# Altium schematic sheet Power.SchDoc
size A3
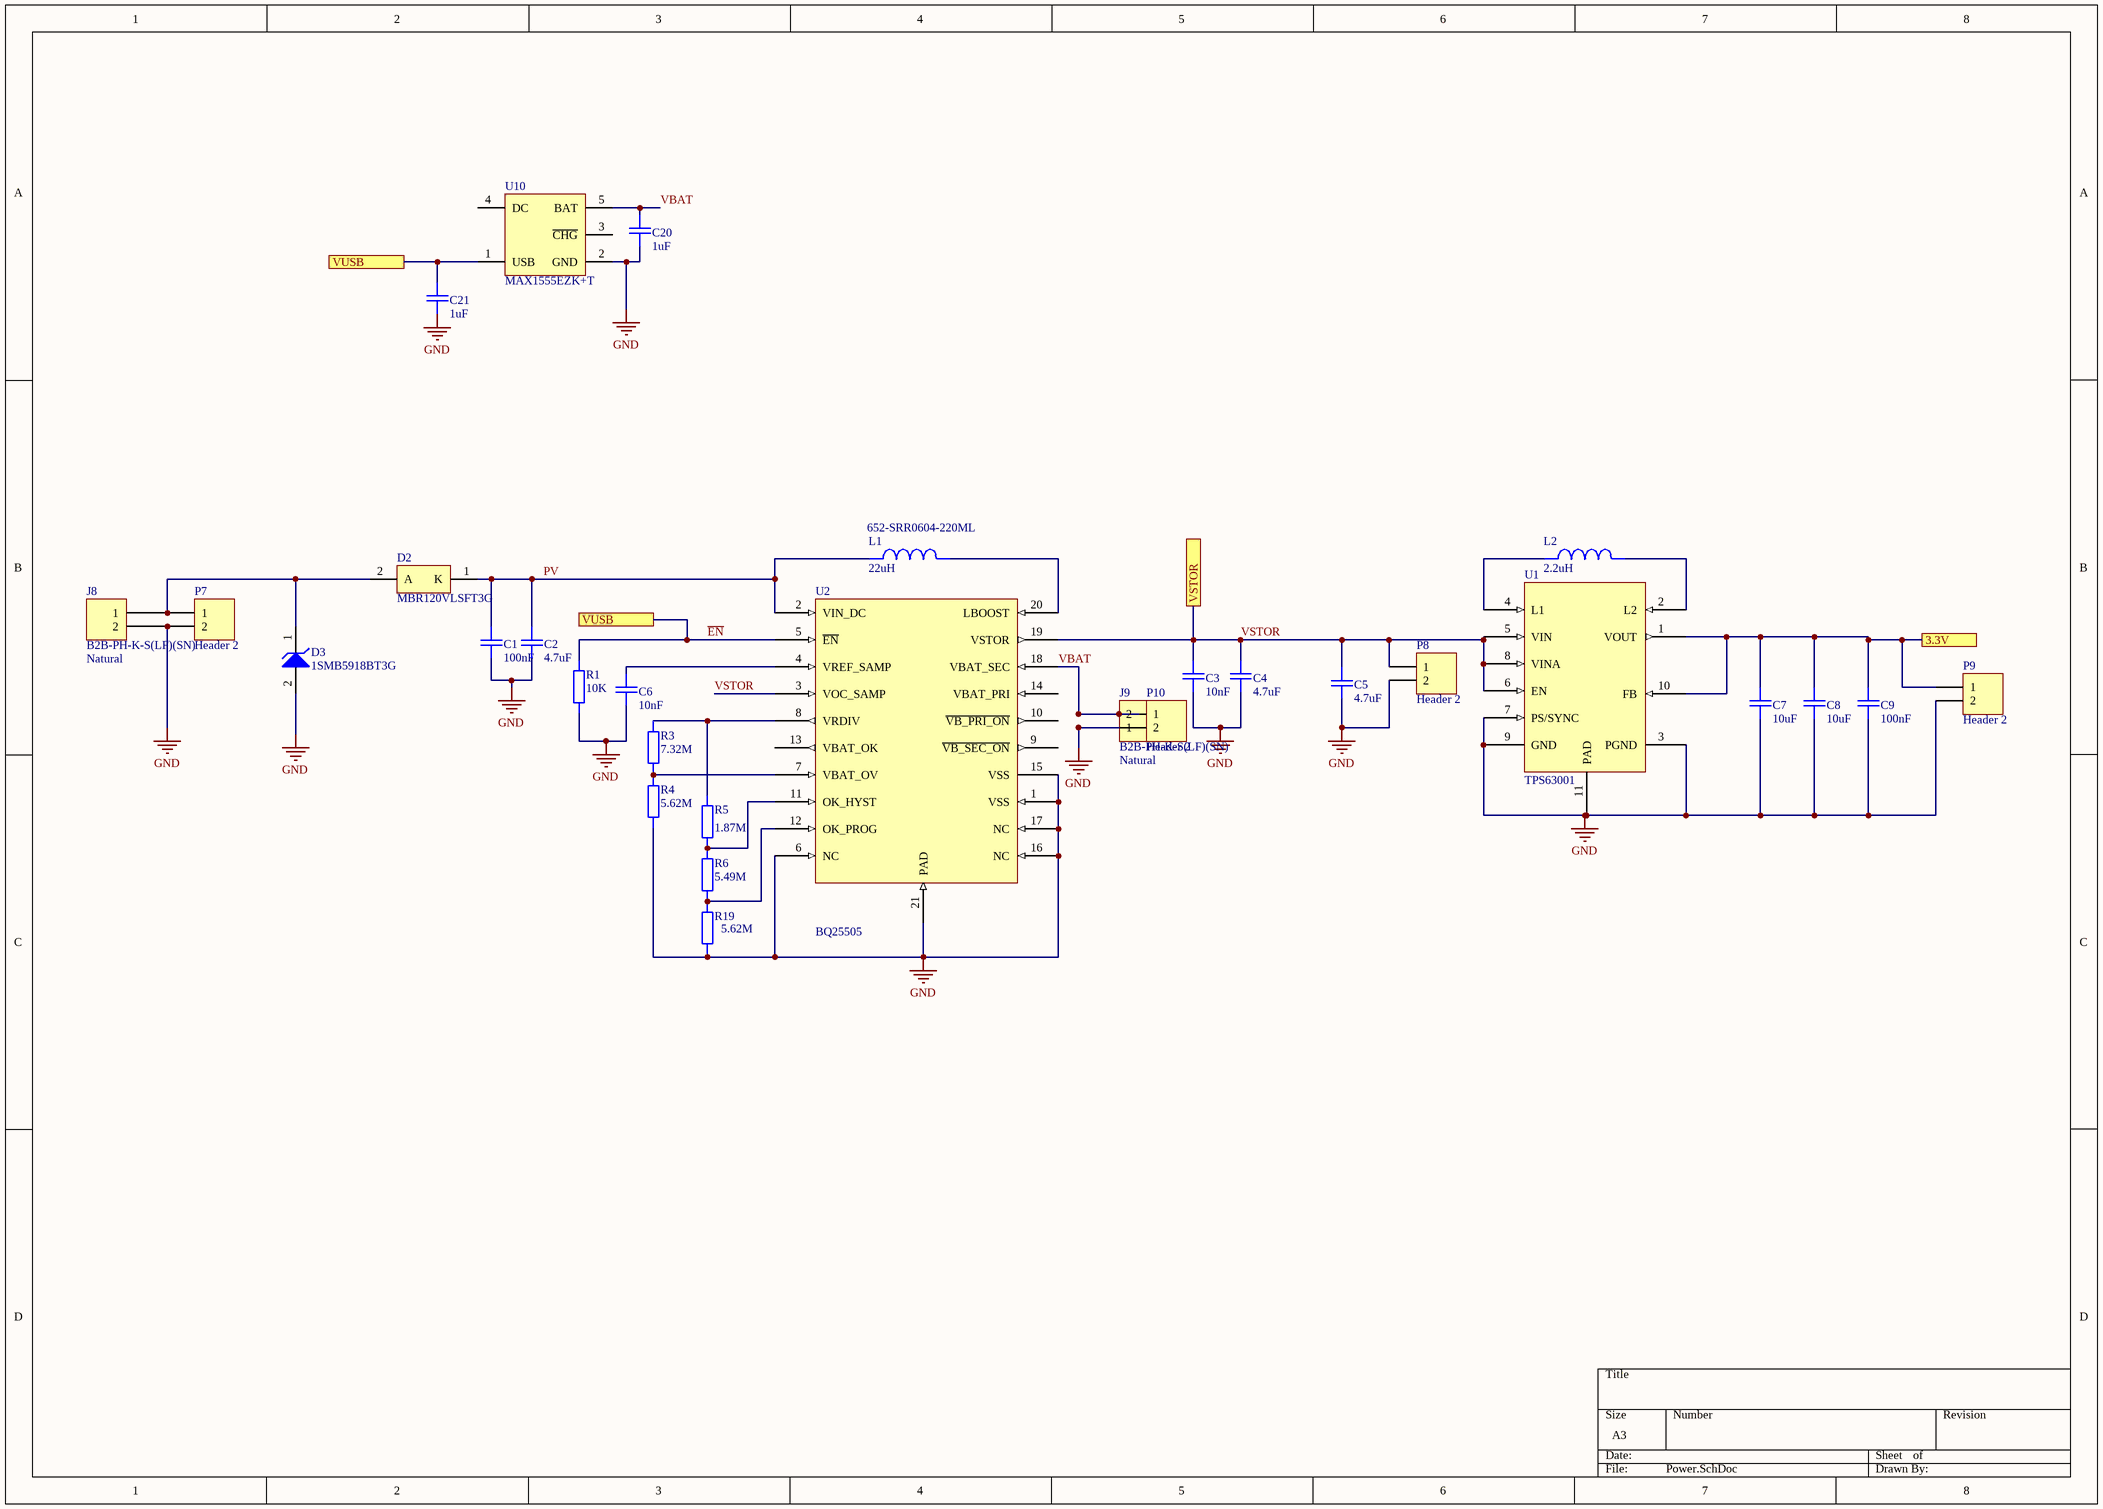
[diagram p0: Power.SchDoc]

## Parts
C1  value 100nF  [C0805]  (hidden comment: Capacitor)
C2  value 4.7uF  [C0805]  (hidden comment: Capacitor)
C3  value 10nF  [C0805]  (hidden comment: Capacitor)
C4  value 4.7uF  [C0805]  (hidden comment: Capacitor)
C5  value 4.7uF  [C0805]  (hidden comment: Capacitor)
C6  value 10nF  [C0805]  (hidden comment: Capacitor)
C7  value 10uF  [C0805]  (hidden comment: Capacitor)
C8  value 10uF  [C0805]  (hidden comment: Capacitor)
C9  value 100nF  [C0805]  (hidden comment: Capacitor)
C20  value 1uF  [C0805]  (hidden comment: Capacitor)
C21  value 1uF  [C0805]  (hidden comment: Capacitor)
D2  MBR120VLSFT3G  [ONSC-SOD-123FL-2-498-01_V]
D3  1SMB5918BT3G  [ONSC-SMB-2-403A-03_H_V]
J8  B2B-PH-K-S(LF)(SN)  Colour: Natural  [JST B2B-PH-K]
J9  B2B-PH-K-S(LF)(SN)  Colour: Natural  [JST B2B-PH-K]
L1  value 22uH  Supplier Part Number 1: 652-SRR0604-220ML  [SRR0604]  (hidden comment: Inductor)
L2  value 2.2uH  [MLP2520]  (hidden comment: Inductor)
P7  Header 2  [HDR1X2]
P8  Header 2  [HDR1X2]
P9  Header 2  [HDR1X2]
P10  Header 2  [HDR1X2]
R1  value 10K  [6-0805_L]  (hidden comment: Resistor)
R3  value 7.32M  [6-0805_L]  (hidden comment: Resistor)
R4  value 5.62M  [6-0805_L]  (hidden comment: Resistor)
R5  value 1.87M  [6-0805_L]  (hidden comment: Resistor)
R6  value 5.49M  [6-0805_L]  (hidden comment: Resistor)
R19  value 5.62M  [6-0805_L]  (hidden comment: Resistor)
U1  TPS63001  [DRC0010J]
U2  BQ25505  [S-PVQFN-N20]
U10  MAX1555EZK+T  [MAXM-Z5+1_N]

## Ports
3.3V, VSTOR, VUSB

## Nets
GND: C1.2 C2.2 C3.2 C4.2 C5.2 C6.2 C7.2 C8.2 C9.2 C20.2 C21.2 D3.2(A) J8.2 J9.1 P7.2 P8.2 P9.2 P10.2 R1.2 R4.2 R19.2 U1.3(PGND) U1.7(PS/SYNC) U1.9(GND) U1.11(PAD) U2.1(VSS) U2.6(NC) U2.15(VSS) U2.16(NC) U2.17(NC) U2.21(PAD) U10.2(GND)
3.3V: C7.1 C8.1 C9.1 P9.1 U1.1(VOUT) U1.10(FB) ; port 3.3V
~{EN}: C21.1 R1.1 U2.5(~{EN}) U10.1(USB) ; port VUSB
PV: C1.1 C2.1 D2.1(K) L1.1 U2.2(VIN_DC)
VBAT: C20.1 J9.2 P10.1 U2.18(VBAT_SEC) U10.5(BAT)
VSTOR: C3.1 C4.1 C5.1 P8.1 U1.5(VIN) U1.6(EN) U1.8(VINA) U2.3(VOC_SAMP) U2.19(VSTOR) ; port VSTOR
NetC6_1: C6.1 U2.4(VREF_SAMP)
NetD2_2: D2.2(A) D3.1(K) J8.1 P7.1
NetL1_2: L1.2 U2.20(LBOOST)
NetL2_1: L2.1 U1.4(L1)
NetL2_2: L2.2 U1.2(L2)
NetR3_1: R3.1 R5.1 U2.8(VRDIV)
NetR3_2: R3.2 R4.1 U2.7(VBAT_OV)
NetR5_2: R5.2 R6.1 U2.11(OK_HYST)
NetR6_2: R6.2 R19.1 U2.12(OK_PROG)

Not connected (* = marked no-connect by the designer): U2 9(~{VB_SEC_ON}) 10(~{VB_PRI_ON}) 13(VBAT_OK) 14(VBAT_PRI); U10 3(~{CHG}) 4(DC)

## Library data of the parts
C1-C9 C20 C21 = Capacitor: Voltage: 16V; Tolerance: 10%; Package: 0603
D2 = CMP-1055-00447-1: Schottky Power Rectifier, 2-Pin SOD-123, Pb-Free, Tape and Reel; Manufacturer: On Semiconductor; Configuration: Single; IFSM Max (A): 45; ComponentLink2URL: http://www.onsemi.cn/pub_link/Collateral/MBR120VLSFT1-D.PDF; PartNumber: MBR120VLSFT3G; DatasheetVersion: Rev. 2; PackageVersion: Rev. A; PackageDescription: 2-Pin SOD, Body 1.65 x 2.7 mm; ComponentLink1URL: http://www.onsemi.com/; ComponentLink3URL: http://www.onsemi.cn/pub_link/Collateral/MBR120VLSFT1-D.PDF; Packing: Tape and Reel; Mounting Technology: Surface Mount; ComponentLink1Description: Manufacturer URL; ComponentLink3Description: Package Specification; ComponentLink2Description: Datasheet; PackageReference: SOD-123FL-2-498-01; RoHS: TRUE
D3 = CMP-1060-00206-1: 3 W Zener Voltage Regulator, 2-Pin SMB, Pb-Free, Tape and Reel; Manufacturer: On Semiconductor; VZ Typ (V): 5.1; ComponentLink3URL: http://www.onsemi.com/pub_link/Collateral/1SMB5913BT3-D.PDF; Mounting Technology: Surface Mount; Packing: Tape and Reel; ComponentLink3Description: Package Specification; ComponentLink2URL: http://www.onsemi.com/pub_link/Collateral/1SMB5913BT3-D.PDF; DatasheetVersion: Rev. 8; PackageReference: SMB-2-403A-03_H; ComponentLink2Description: Datasheet; ComponentLink1Description: Manufacturer URL; ComponentLink1URL: http://www.onsemi.com/; RoHS: Pb-Free; PackageDescription: 2-Pin Small Molded Package, J-Bend Lead, Body 4.33 x 3.625 mm; PartNumber: 1SMB5918BT3G; PackageVersion: Rev. H, 05/2011
J8 J9 = B2B-PH-K-S(LF)(SN): CONN HEADER PH TOP 2POS 2MM; Manufacturer: JST Sales America Inc.; Pitch: 0.079" (2.00mm); Number Of Positions: 2; Part Number: B2B-PH-K-S(LF)(SN); PartId: 29447; Supplier 1: Digi-Key; Supplier Part Number 1: 455-1704-ND; ComponentLink1Description: Datasheet; ComponentLink1URL: http://www.jst-mfg.com/product/pdf/eng/ePH.pdf; ComponentLink2Description: Digi-Key Listing; ComponentLink2URL: http://www.digikey.com/product-detail/en/jst-sales-america-inc/B2B-PH-K-S(LF)(SN)/455-1704-ND/926611; Price: 0,17; Type: Header, Shrouded; Contact Finish: Tin; Fastening Type: Detent Lock; Number Of Rows: 1; Series: PH
L1 = Inductor: Manufacturer: Bourns; Core Material: Ferrite; Material: Steel; Tolerance: 20%; Max DC Current: 900mA; DC Resistance (DCR): 190mR; Self Resonant Frequency: 25MHz; Q Factor: 16; Shielding: Shielded; Saturation Current: 1.2A; Test Frequency: 1kHz; Supplier 1: Mouser; Stock 1: 4936; Pricing 1: 1=0.71, 10=0.658, 50=0.658, 100=0.476, 1000=0.365, 10000=0.365 (USD); Mount: Surface Mount; Case/Package: 0604; Min Operating Temperature: -40°C; Max Operating Temperature: 125°C; Inductance: 22uh; Packaging: Tape and Reel; Package Quantity: 1000; Inductance Tolerance: 20%; Current Rating: 900mA; Frequency: 25MHz; Resistance: 190MR; Termination: SMD/SMT; Composition: Wirewound; DC Current: 900mA; Military Standard: Not; RMS Current (Irms): 900mA; Length: 6.5mm; Height: 4.8mm; Width: 6.5mm; Height - Seated (Max): 0.189inch; Depth: 6.7mm; REACH SVHC: No SVHC; ComponentLink1URL: http://uk.rs-online.com/webdocs/0fa5/0900766b80fa5950.pdf; ComponentLink1Description: http://uk.rs-online.com/webdocs/0fa5/0900766b80fa5950.pdf; ComponentLink2URL: https://www.alliedelec.com/m/d/db85a2264958f44ba0f102d64e276dc0.pdf; ComponentLink2Description: https://www.alliedelec.com/m/d/db85a2264958f44ba0f102d64e276dc0.pdf; ComponentLink3URL: http://www.bourns.com/docs/Product-Datasheets/SRR0604.pdf; ComponentLink3Description: http://www.bourns.com/docs/Product-Datasheets/SRR0604.pdf; ComponentLink4URL: https://www.bourns.com/docs/Product-Datasheets/SRR0604.pdf; ComponentLink4Description: https://www.bourns.com/docs/Product-Datasheets/SRR0604.pdf; ComponentLink5URL: http://www.farnell.com/datasheets/1723201.pdf; ComponentLink5Description: http://www.farnell.com/datasheets/1723201.pdf; ComponentLink6URL: http://components.arrow.com/part/dataview/41632166S7459348N1506; ComponentLink6Description: http://components.arrow.com/part/dataview/41632166S7459348N1506; ComponentLink7URL: http://www.bourns.com/pdfs/SRR0604.pdf; ComponentLink7Description: http://www.bourns.com/pdfs/SRR0604.pdf
P7-P10 = Header 2: Header, 2-Pin; LatestRevisionDate: 17-Jul-2002; LatestRevisionNote: Re-released for DXP Platform.; Publisher: Altium Limited
R1 R3-R6 R19 = Resistor: Tolerance: 1%; Power Rating: 1/4W; Package: 0602
U10 = CMP-0246-00648-1: Dual-Input USB/AC Adapter 1-Cell Li+ Battery Charger, 4.2 V Charger Voltage, 0.28 A DC Charging Current, 5-Pin TSOT Package, RoHS, Tape and Reel; Manufacturer: Maxim; Max Protected VIN (V): 7; ICHG Typ: 0.28 A; Lithium Ion Cells: 1; Charger (V): 4.2; ComponentLink3URL: http://pdfserv.maximintegrated.com/package_dwgs/21-0113.PDF; PackageDescription: 5-Pin Thin SOT23, Body 2.9 x 1.6 mm, Pitch 0.95 mm; Max Charging VIN (V): 7; Packing: Tape and Reel; PackageReference: Z5+1; ComponentLink3Description: Package Specification; ComponentLink1Description: Manufacturer URL; Package: TSOT; Operating Temperature Range: -40 to 85 degC; RoHS: TRUE; Mounting Technology: Surface Mount; PartNumber: MAX1555EZK+T; DatasheetVersion: Rev. 0; ComponentLink2Description: Datasheet; ComponentLink2URL: http://datasheets.maximintegrated.com/en/ds/MAX1551-MAX1555.pdf; PackageVersion: Rev. D; ComponentLink1URL: http://www.maximintegrated.com/
U1 = TPS63001: ComponentLink1Description: datasheet; ComponentLink1URL: http://www.ti.com/lit/ds/symlink/tps63001.pdf
U2 = BQ25505: ComponentLink1Description: datasheet; ComponentLink1URL: http://www.ti.com/lit/ds/symlink/bq25505.pdf